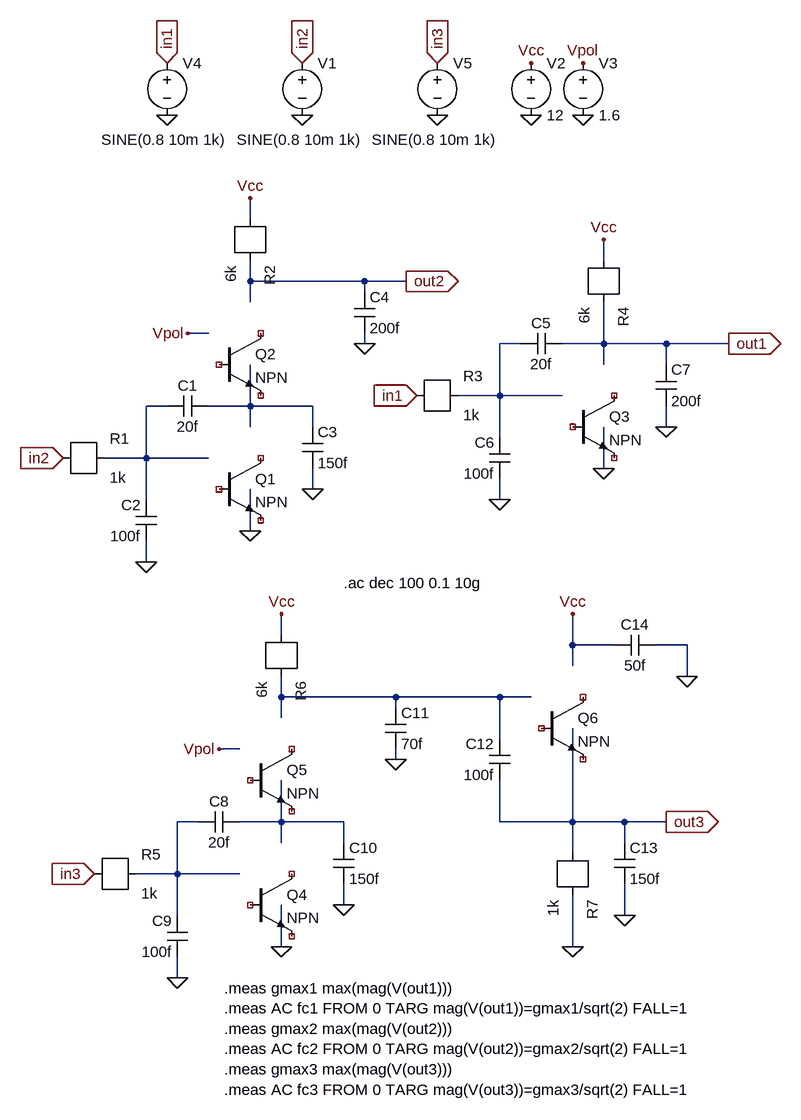
[diagram p0: schematic melo_impedance.asc]
melo_impedance.asc, the LTspice schematic file:
Version 4
SHEET 1 1156 1440
WIRE 272 48 272 16
WIRE 816 112 816 80
WIRE 272 144 272 112
WIRE 448 144 272 144
WIRE 512 144 448 144
WIRE 448 160 448 144
WIRE 272 176 272 144
WIRE 208 224 176 224
WIRE 448 240 448 224
WIRE 688 240 656 240
WIRE 816 240 816 176
WIRE 816 240 752 240
WIRE 912 240 816 240
WIRE 1008 240 912 240
WIRE 816 272 816 240
WIRE 912 272 912 240
WIRE 656 320 656 240
WIRE 656 320 592 320
WIRE 752 320 656 320
WIRE 144 336 112 336
WIRE 272 336 272 272
WIRE 272 336 208 336
WIRE 368 336 272 336
WIRE 272 368 272 336
WIRE 368 368 368 336
WIRE 912 368 912 336
WIRE 656 384 656 320
WIRE 112 416 112 336
WIRE 112 416 48 416
WIRE 208 416 112 416
WIRE 816 432 816 368
WIRE 368 464 368 432
WIRE 112 480 112 416
WIRE 656 480 656 448
WIRE 272 528 272 464
WIRE 112 576 112 544
WIRE 320 688 320 656
WIRE 768 704 768 656
WIRE 832 704 768 704
WIRE 944 704 896 704
WIRE 768 736 768 704
WIRE 944 752 944 704
WIRE 320 784 320 752
WIRE 496 784 320 784
WIRE 656 784 496 784
WIRE 704 784 656 784
WIRE 496 800 496 784
WIRE 320 816 320 784
WIRE 656 848 656 784
WIRE 256 864 224 864
WIRE 496 880 496 864
WIRE 192 976 160 976
WIRE 320 976 320 912
WIRE 320 976 256 976
WIRE 416 976 320 976
WIRE 656 976 656 912
WIRE 768 976 768 832
WIRE 768 976 656 976
WIRE 848 976 768 976
WIRE 912 976 848 976
WIRE 320 1008 320 976
WIRE 416 1008 416 976
WIRE 848 1008 848 976
WIRE 768 1024 768 976
WIRE 160 1056 160 976
WIRE 160 1056 96 1056
WIRE 256 1056 160 1056
WIRE 416 1104 416 1072
WIRE 160 1120 160 1056
WIRE 848 1120 848 1072
WIRE 320 1168 320 1104
WIRE 768 1168 768 1088
WIRE 160 1216 160 1184
FLAG 352 -112 0
FLAG 704 -112 0
FLAG 352 -192 in2
IOPIN 352 -192 In
FLAG -16 416 in2
IOPIN -16 416 In
FLAG 704 -192 Vcc
FLAG 272 16 Vcc
FLAG 368 464 0
FLAG 272 528 0
FLAG 112 576 0
FLAG 784 -112 0
FLAG 784 -192 Vpol
FLAG 176 224 Vpol
FLAG 512 144 out2
IOPIN 512 144 Out
FLAG 448 240 0
FLAG 1008 240 out1
IOPIN 1008 240 Out
FLAG 144 -112 0
FLAG 144 -192 in1
IOPIN 144 -192 In
FLAG 528 320 in1
IOPIN 528 320 In
FLAG 816 80 Vcc
FLAG 912 368 0
FLAG 816 432 0
FLAG 656 480 0
FLAG 560 -112 0
FLAG 560 -192 in3
IOPIN 560 -192 In
FLAG 32 1056 in3
IOPIN 32 1056 In
FLAG 320 656 Vcc
FLAG 416 1104 0
FLAG 320 1168 0
FLAG 160 1216 0
FLAG 224 864 Vpol
FLAG 912 976 out3
IOPIN 912 976 Out
FLAG 496 880 0
FLAG 768 656 Vcc
FLAG 768 1168 0
FLAG 848 1120 0
FLAG 944 752 0
SYMBOL npn 224 416 R0
SYMATTR InstName Q1
SYMBOL r -16 416 R0
SYMATTR InstName R1
SYMATTR Value 1k
SYMBOL r 272 48 R90
SYMATTR InstName R2
SYMATTR Value 6k
SYMBOL cap 208 320 R90
WINDOW 0 0 32 VBottom 2
WINDOW 3 32 32 VTop 2
SYMATTR InstName C1
SYMATTR Value 20f
SYMBOL cap 128 544 R180
WINDOW 0 24 56 Left 2
WINDOW 3 24 8 Left 2
SYMATTR InstName C2
SYMATTR Value 100f
SYMBOL voltage 352 -208 R0
WINDOW 3 -101 134 Left 2
SYMATTR Value SINE(0.8 10m 1k)
SYMATTR InstName V1
SYMATTR Value2 AC 1
SYMBOL voltage 704 -208 R0
SYMATTR InstName V2
SYMATTR Value 12
SYMBOL cap 352 368 R0
SYMATTR InstName C3
SYMATTR Value 150f
SYMBOL npn 224 224 R0
SYMATTR InstName Q2
SYMBOL voltage 784 -208 R0
SYMATTR InstName V3
SYMATTR Value 1.6
SYMBOL cap 432 160 R0
SYMATTR InstName C4
SYMATTR Value 200f
SYMBOL npn 768 320 R0
SYMATTR InstName Q3
SYMBOL r 528 320 R0
SYMATTR InstName R3
SYMATTR Value 1k
SYMBOL r 816 112 R90
SYMATTR InstName R4
SYMATTR Value 6k
SYMBOL cap 752 224 R90
WINDOW 0 0 32 VBottom 2
WINDOW 3 32 32 VTop 2
SYMATTR InstName C5
SYMATTR Value 20f
SYMBOL cap 672 448 R180
WINDOW 0 24 56 Left 2
WINDOW 3 24 8 Left 2
SYMATTR InstName C6
SYMATTR Value 100f
SYMBOL voltage 144 -208 R0
WINDOW 3 -101 134 Left 2
SYMATTR Value SINE(0.8 10m 1k)
SYMATTR InstName V4
SYMATTR Value2 AC 1
SYMBOL cap 896 272 R0
SYMATTR InstName C7
SYMATTR Value 200f
SYMBOL npn 272 1056 R0
SYMATTR InstName Q4
SYMBOL r 32 1056 R0
SYMATTR InstName R5
SYMATTR Value 1k
SYMBOL r 320 688 R90
SYMATTR InstName R6
SYMATTR Value 6k
SYMBOL cap 256 960 R90
WINDOW 0 0 32 VBottom 2
WINDOW 3 32 32 VTop 2
SYMATTR InstName C8
SYMATTR Value 20f
SYMBOL cap 176 1184 R180
WINDOW 0 24 56 Left 2
WINDOW 3 24 8 Left 2
SYMATTR InstName C9
SYMATTR Value 100f
SYMBOL voltage 560 -208 R0
WINDOW 3 -101 134 Left 2
SYMATTR Value SINE(0.8 10m 1k)
SYMATTR InstName V5
SYMATTR Value2 AC 1
SYMBOL cap 400 1008 R0
SYMATTR InstName C10
SYMATTR Value 150f
SYMBOL npn 272 864 R0
SYMATTR InstName Q5
SYMBOL cap 480 800 R0
SYMATTR InstName C11
SYMATTR Value 70f
SYMBOL npn 720 784 R0
SYMATTR InstName Q6
SYMBOL cap 672 912 R180
WINDOW 0 24 56 Left 2
WINDOW 3 24 8 Left 2
SYMATTR InstName C12
SYMATTR Value 100f
SYMBOL r 768 1024 R90
SYMATTR InstName R7
SYMATTR Value 1k
SYMBOL cap 832 1008 R0
SYMATTR InstName C13
SYMATTR Value 150f
SYMBOL cap 896 688 R90
WINDOW 0 0 32 VBottom 2
WINDOW 3 32 32 VTop 2
SYMATTR InstName C14
SYMATTR Value 50f
TEXT 416 608 Left 2 !.ac dec 100 0.1 10g
TEXT 232 1232 Left 2 !.meas gmax1 max(mag(V(out1)))\n.meas AC fc1 FROM 0 TARG mag(V(out1))=gmax1/sqrt(2) FALL=1\n.meas gmax2 max(mag(V(out2)))\n.meas AC fc2 FROM 0 TARG mag(V(out2))=gmax2/sqrt(2) FALL=1\n.meas gmax3 max(mag(V(out3)))\n.meas AC fc3 FROM 0 TARG mag(V(out3))=gmax3/sqrt(2) FALL=1

The netlist it stands for:
* melo_impedance.asc
* Q1: NPN (symbol npn not certain, pin order unknown); nets seen at it: 0
R1 N002 in2 1k
R2 out2 Vcc 6k
C1 N003 N002 20f
C2 0 N002 100f
V1 in2 0 SINE(0.8 10m 1k) AC 1
V2 Vcc 0 12
C3 N003 0 150f
* Q2: NPN (symbol npn not certain, pin order unknown); nets seen at it: 0
V3 Vpol 0 1.6
C4 out2 0 200f
* Q3: NPN (symbol npn not certain, pin order unknown); nets seen at it: 0
R3 N001 in1 1k
R4 out1 Vcc 6k
C5 out1 N001 20f
C6 0 N001 100f
V4 in1 0 SINE(0.8 10m 1k) AC 1
C7 out1 0 200f
* Q4: NPN (symbol npn not certain, pin order unknown); nets seen at it: 0
R5 N005 in3 1k
R6 N004 Vcc 6k
C8 N006 N005 20f
C9 0 N005 100f
V5 in3 0 SINE(0.8 10m 1k) AC 1
C10 N006 0 150f
* Q5: NPN (symbol npn not certain, pin order unknown); nets seen at it: 0
C11 N004 0 70f
* Q6: NPN (symbol npn not certain, pin order unknown); nets seen at it: 0
C12 out3 N004 100f
R7 0 out3 1k
C13 out3 0 150f
C14 0 Vcc 50f
.ac dec 100 0.1 10g
.meas gmax1 max(mag(V(out1)))
.meas AC fc1 FROM 0 TARG mag(V(out1))=gmax1/sqrt(2) FALL=1
.meas gmax2 max(mag(V(out2)))
.meas AC fc2 FROM 0 TARG mag(V(out2))=gmax2/sqrt(2) FALL=1
.meas gmax3 max(mag(V(out3)))
.meas AC fc3 FROM 0 TARG mag(V(out3))=gmax3/sqrt(2) FALL=1
.backanno
.end